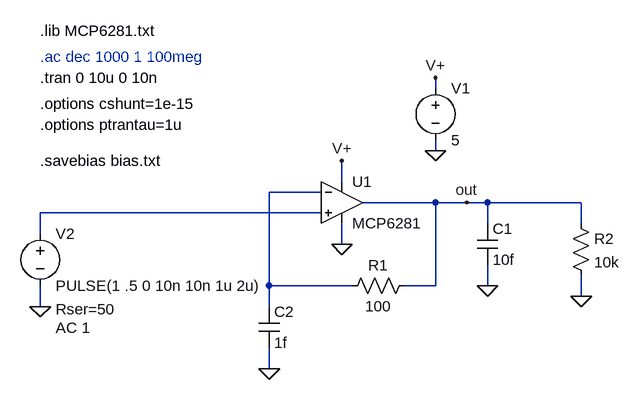
[diagram p0: schematic MCP6281_test.asc]
MCP6281_test.asc, the LTspice schematic file:
Version 4
SHEET 1 976 680
WIRE 368 -64 368 -80
WIRE 368 32 368 16
WIRE 224 80 224 48
WIRE 192 96 112 96
WIRE 368 112 256 112
WIRE 416 112 368 112
WIRE 448 112 416 112
WIRE 592 112 448 112
WIRE 192 128 -240 128
WIRE 448 144 448 112
WIRE 592 144 592 112
WIRE -240 160 -240 128
WIRE 224 176 224 144
WIRE 112 240 112 96
WIRE 240 240 112 240
WIRE 368 240 368 112
WIRE 368 240 320 240
WIRE 448 240 448 208
WIRE 592 256 592 224
WIRE -240 272 -240 240
WIRE 112 272 112 240
WIRE 112 368 112 336
FLAG 224 176 0
FLAG 368 32 0
FLAG -240 272 0
FLAG 448 240 0
FLAG 416 112 out
FLAG 112 368 0
FLAG 592 256 0
FLAG 224 48 V+
FLAG 368 -80 V+
SYMBOL voltage 368 -80 R0
WINDOW 123 0 0 Left 0
WINDOW 39 24 44 Left 0
SYMATTR InstName V1
SYMATTR Value 5
SYMBOL voltage -240 144 R0
WINDOW 123 24 161 Left 0
WINDOW 39 24 132 Left 0
SYMATTR Value2 AC 1
SYMATTR SpiceLine Rser=50
SYMATTR InstName V2
SYMATTR Value PULSE(1 .5 0 10n 10n 1u 2u)
SYMBOL cap 432 144 R0
SYMATTR InstName C1
SYMATTR Value 10f
SYMBOL res 224 256 R270
WINDOW 0 32 56 VTop 0
WINDOW 3 0 56 VBottom 0
SYMATTR InstName R1
SYMATTR Value 100
SYMBOL cap 96 272 R0
SYMATTR InstName C2
SYMATTR Value 1f
SYMBOL res 576 128 R0
SYMATTR InstName R2
SYMATTR Value 10k
SYMBOL Opamps\\opamp2 224 48 R0
SYMATTR InstName U1
SYMATTR Value MCP6281
TEXT -240 -80 Left 0 !.tran 0 10u 0 10n
TEXT -240 -40 Left 0 !.options cshunt=1e-15
TEXT -240 -112 Left 0 ;.ac dec 1000 1 100meg
TEXT -240 48 Left 0 !.savebias bias.txt
TEXT -240 -8 Left 0 !.options ptrantau=1u
TEXT -240 -152 Left 0 !.lib MCP6281.txt

The netlist it stands for:
* MCP6281_test.asc
V1 V+ 0 5
V2 N002 0 PULSE(1 .5 0 10n 10n 1u 2u) AC 1 Rser=50
C1 out 0 10f
R1 N001 out 100
C2 N001 0 1f
R2 out 0 10k
XU1 N002 N001 V+ 0 out MCP6281  ; pins In+ In- V+ V- OUT
.tran 0 10u 0 10n
.options cshunt=1e-15
* .ac dec 1000 1 100meg
.savebias bias.txt
.options ptrantau=1u
.lib MCP6281.txt
.backanno
.end